# EAGLE design cw506_advbreak (EAGLE 7.5.0)

## Sheet 1 of 2
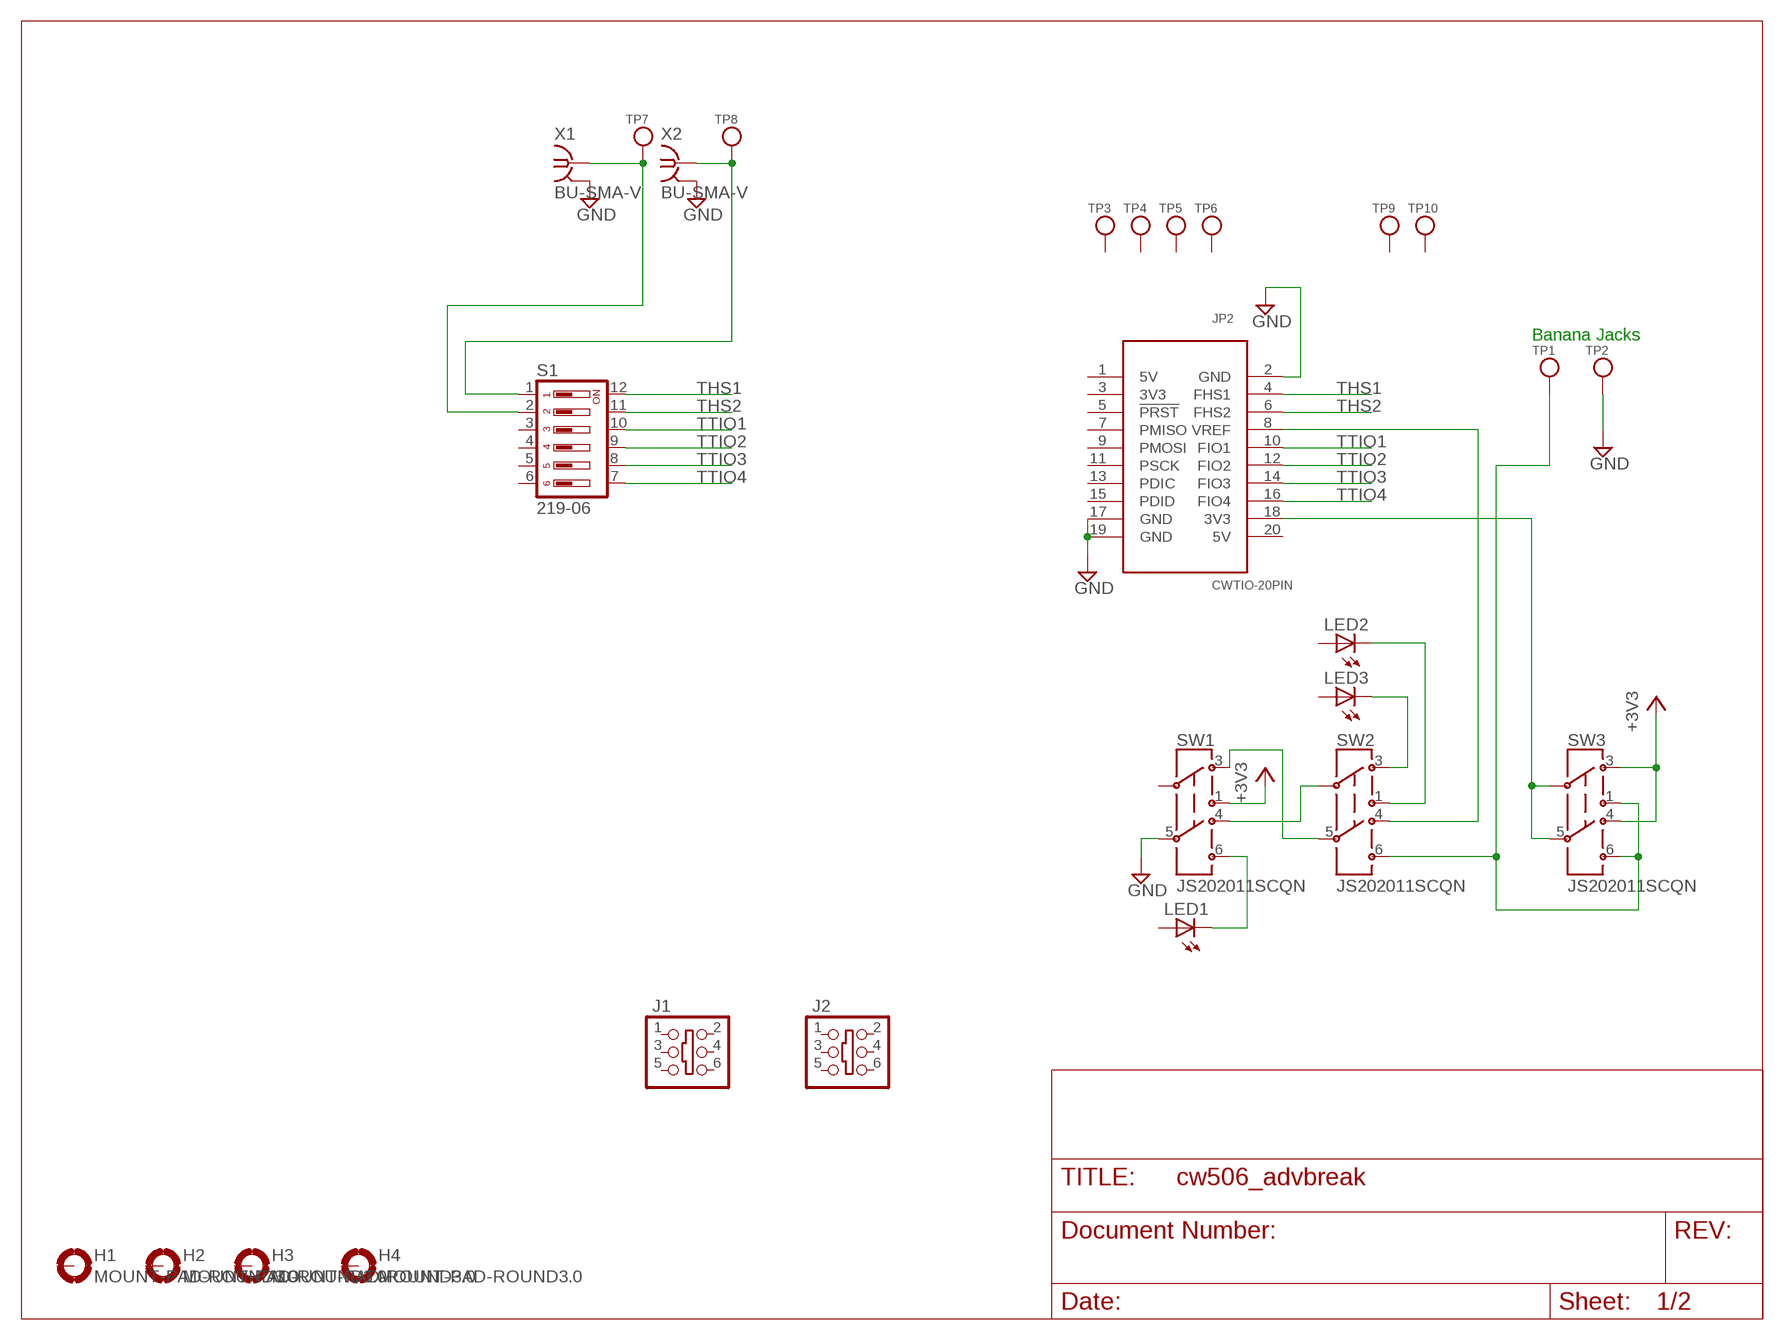
[diagram p0: schematic, sheet 1]

### Parts
H1  MOUNT-PAD-ROUND3.0  [3,0-PAD]
H2  MOUNT-PAD-ROUND3.0  [3,0-PAD]
H3  MOUNT-PAD-ROUND3.0  [3,0-PAD]
H4  MOUNT-PAD-ROUND3.0  [3,0-PAD]
J1  SHROUD_2X3  [PINSHRD_PTH_2X03]
J2  SHROUD_2X3  [PINSHRD_PTH_2X03]
JP2  CWTIO-20PIN  [PINSHRD_PTH_2X10]
LED1  LEDCHIP-LED0603  [CHIP-LED0603]
LED2  LEDCHIP-LED0603  [CHIP-LED0603]
LED3  LEDCHIP-LED0603  [CHIP-LED0603]
S1  219-06  [CTS-219-06]
SW1  JS202011SCQN  [JS202011SCQN]
SW2  JS202011SCQN  [JS202011SCQN]
SW3  JS202011SCQN  [JS202011SCQN]
TP1  TPK575-4  [KEYSTONE575-4]
TP2  TPK575-4  [KEYSTONE575-4]
TP3  TPKEYSTONE_COMPACT  [KEYSTONE_TPCOMPACT]
TP4  TPKEYSTONE_COMPACT  [KEYSTONE_TPCOMPACT]
TP5  TPKEYSTONE_COMPACT  [KEYSTONE_TPCOMPACT]
TP6  TPKEYSTONE_COMPACT  [KEYSTONE_TPCOMPACT]
TP7  TPKEYSTONE_COMPACT  [KEYSTONE_TPCOMPACT]
TP8  TPKEYSTONE_COMPACT  [KEYSTONE_TPCOMPACT]
TP9  TPKEYSTONE_COMPACT  [KEYSTONE_TPCOMPACT]
TP10  TPKEYSTONE_COMPACT  [KEYSTONE_TPCOMPACT]
X1  BU-SMA-V  [BU-SMA-V]
X2  BU-SMA-V  [BU-SMA-V]

### Nets
+3V3: SW1.1 SW3.3 SW3.4 ; also sheet 2
GND: JP2.2(GND) JP2.17(GND) JP2.19(GND) SW1.5 TP2.1(TP) X1.2 X1.3 X1.4 X1.5 X2.2 X2.3 X2.4 X2.5
N$1: SW1.3 SW2.5
N$2: LED1.C SW1.6
N$3: SW1.4 SW2.2
N$4: JP2.8(VREF) SW2.4
N$5: LED3.C SW2.3
N$6: LED2.C SW2.1
N$7: SW2.6 SW3.1 SW3.6 TP1.1(TP)
N$8: JP2.18(3V3) SW3.2 SW3.5
N$9: S1.2 TP7.1(TP) X1.1
N$10: S1.1 TP8.1(TP) X2.1
THS1: JP2.4(FHS1) S1.12
THS2: JP2.6(FHS2) S1.11
TTIO1: JP2.10(FIO1) S1.10
TTIO2: JP2.12(FIO2) S1.9
TTIO3: JP2.14(FIO3) S1.8
TTIO4: JP2.16(FIO4) S1.7
Unconnected: H1.B3,0(MOUNT) H2.B3,0(MOUNT) H3.B3,0(MOUNT) H4.B3,0(MOUNT) J1.1 J1.2 J1.3 J1.4 J1.5 J1.6 J2.1 J2.2 J2.3 J2.4 J2.5 J2.6 JP2.1(5V) JP2.3(3V3) JP2.5(!PRST) JP2.7(PMISO) JP2.9(PMOSI) JP2.11(PSCK) JP2.13(PDIC) JP2.15(PDID) JP2.20(5V) LED1.A LED2.A LED3.A S1.3 S1.4 S1.5 S1.6 SW1.2 TP3.1(TP) TP4.1(TP) TP5.1(TP) TP6.1(TP) TP9.1(TP) TP10.1(TP)

### Notes on the sheet
- Banana Jacks

## Sheet 2 of 2
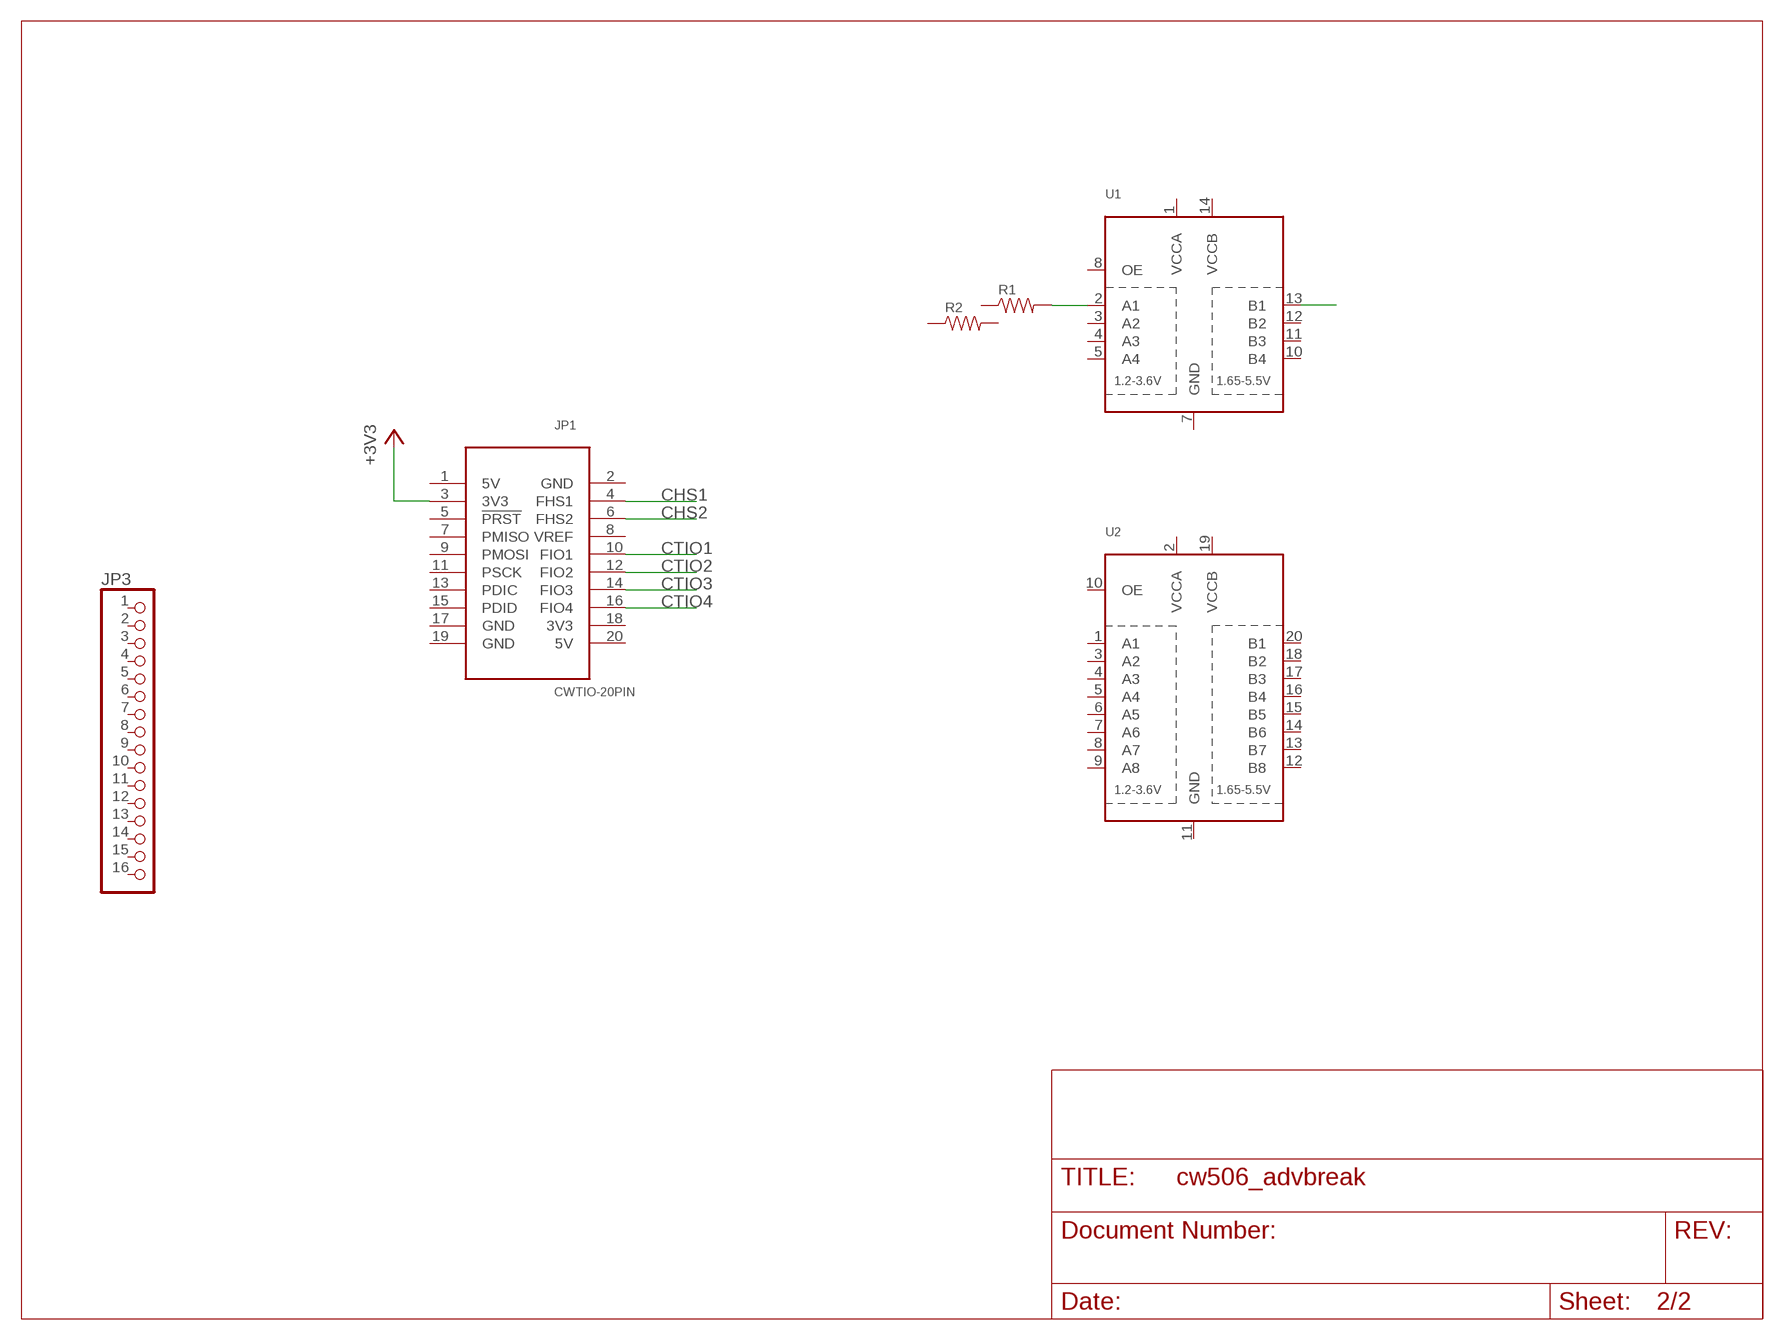
[diagram p1: schematic, sheet 2]

### Parts
JP1  CWTIO-20PIN  [PINSHRD_PTH_2X10]
JP3  PINHD-1X16  [1X16]
R1  RES0603-RES  [0603R]
R2  RES0603-RES  [0603R]
U1  TXB0104PWR  [TSSOP14]
U2  TXB0108PWR  [TSSOP20]

### Nets
+3V3: JP1.3(3V3) ; also sheet 1
CHS1: JP1.4(FHS1)
CHS2: JP1.6(FHS2)
CTIO1: JP1.10(FIO1)
CTIO2: JP1.12(FIO2)
CTIO3: JP1.14(FIO3)
CTIO4: JP1.16(FIO4)
N$11: R1.2 U1.2(A1)
N$15: U1.13(B1)
Unconnected: JP1.1(5V) JP1.2(GND) JP1.5(!PRST) JP1.7(PMISO) JP1.8(VREF) JP1.9(PMOSI) JP1.11(PSCK) JP1.13(PDIC) JP1.15(PDID) JP1.17(GND) JP1.18(3V3) JP1.19(GND) JP1.20(5V) JP3.1 JP3.2 JP3.3 JP3.4 JP3.5 JP3.6 JP3.7 JP3.8 JP3.9 JP3.10 JP3.11 JP3.12 JP3.13 JP3.14 JP3.15 JP3.16 R1.1 R2.1 R2.2 U1.1(VCCA) U1.3(A2) U1.4(A3) U1.5(A4) U1.7(GND) U1.8(OE) U1.10(B4) U1.11(B3) U1.12(B2) U1.14(VCCB) U2.1(A1) U2.2(VCCA) U2.3(A2) U2.4(A3) U2.5(A4) U2.6(A5) U2.7(A6) U2.8(A7) U2.9(A8) U2.10(OE) U2.11(GND) U2.12(B8) U2.13(B7) U2.14(B6) U2.15(B5) U2.16(B4) U2.17(B3) U2.18(B2) U2.19(VCCB) U2.20(B1)

## Library data of the parts
H1-H4 = holes:MOUNT-PAD-ROUND: MOUNTING PAD, round
J1 J2 = custom-std:SHROUD_2X3: 2x05 pin header
JP1 JP2 = chipwhisperer:CWTIO-20PIN
JP3 = pinhead:PINHD-1X16: PIN HEADER
LED1 = led:LED: LED OSRAM: - CHIPLED LG R971, LG N971, LY N971, LG Q971, LY Q971, LO R971, LY R971 LH N974, LH R974 LS Q976, LO Q976, LY Q976 LO Q996 - Hyper CHIPLED LW Q18S LB Q993, LB Q99A, LB R99A - SideLED LS A670, LO A670, LY A670, LG A670, LP A670 LB A673, LV A673, LT A673, LW A673 LH A674 LY A675 LS A676, LA A676, LO A676, LY A676, LW A676 LS A679, LY A679, LG A679 - Hyper Micro SIDELED® LS Y876, LA Y876, LO Y876, LY Y876 LT Y87S - SmartLED LW L88C, LW L88S LB L89C, LB L89S, LG L890 LS L89K, LO L89K, LY L89K LS L896, LA L896, LO L896, LY L896 - TOPLED LS T670, LO T670, LY T670, LG T670, LP T670 LSG T670, LSP T670, LSY T670, LOP T670, LYG T670 LG T671, LOG T671, LSG T671 LB T673, LV T673, LT T673, LW T673 LH T674 LS T676, LA T676, LO T676, LY T676, LB T676, LH T676, LSB T676, LW T676 LB T67C, LV T67C, LT T67C, LS T67K, LO T67K, LY T67K, LW E67C LS E67B, LA E67B, LO E67B, LY E67B, LB E67C, LV E67C, LT E67C LW T67C LS T679, LY T679, LG T679 LS T770, LO T770, LY T770, LG T770, LP T770 LB T773, LV T773, LT T773, LW T773 LH T774 LS E675, LA E675, LY E675, LS T675 LS T776, LA T776, LO T776, LY T776, LB T776 LHGB T686 LT T68C, LB T68C - Hyper Mini TOPLED® LB M676 - Mini TOPLED Santana® LG M470 LS M47K, LO M47K, LY M47K Source: http://www.osram.convergy.de LUXEON: - LUMILED® LXK2-PW12-R00, LXK2-PW12-S00, LXK2-PW14-U00, LXK2-PW14-V00 LXK2-PM12-R00, LXK2-PM12-S00, LXK2-PM14-U00 LXK2-PE12-Q00, LXK2-PE12-R00, LXK2-PE12-S00, LXK2-PE14-T00, LXK2-PE14-U00 LXK2-PB12-K00, LXK2-PB12-L00, LXK2-PB12-M00, LXK2-PB14-N00, LXK2-PB14-P00, LXK2-PB14-Q00 LXK2-PR12-L00, LXK2-PR12-M00, LXK2-PR14-Q00, LXK2-PR14-R00 LXK2-PD12-Q00, LXK2-PD12-R00, LXK2-PD12-S00 LXK2-PH12-R00, LXK2-PH12-S00 LXK2-PL12-P00, LXK2-PL12-Q00, LXK2-PL12-R00 Source: www.luxeon.com KINGBRIGHT: KA-3528ASYC Source: www.kingbright.com; SILKSCREEN: +3.3V
LED2 LED3 = led:LED: LED OSRAM: - CHIPLED LG R971, LG N971, LY N971, LG Q971, LY Q971, LO R971, LY R971 LH N974, LH R974 LS Q976, LO Q976, LY Q976 LO Q996 - Hyper CHIPLED LW Q18S LB Q993, LB Q99A, LB R99A - SideLED LS A670, LO A670, LY A670, LG A670, LP A670 LB A673, LV A673, LT A673, LW A673 LH A674 LY A675 LS A676, LA A676, LO A676, LY A676, LW A676 LS A679, LY A679, LG A679 - Hyper Micro SIDELED® LS Y876, LA Y876, LO Y876, LY Y876 LT Y87S - SmartLED LW L88C, LW L88S LB L89C, LB L89S, LG L890 LS L89K, LO L89K, LY L89K LS L896, LA L896, LO L896, LY L896 - TOPLED LS T670, LO T670, LY T670, LG T670, LP T670 LSG T670, LSP T670, LSY T670, LOP T670, LYG T670 LG T671, LOG T671, LSG T671 LB T673, LV T673, LT T673, LW T673 LH T674 LS T676, LA T676, LO T676, LY T676, LB T676, LH T676, LSB T676, LW T676 LB T67C, LV T67C, LT T67C, LS T67K, LO T67K, LY T67K, LW E67C LS E67B, LA E67B, LO E67B, LY E67B, LB E67C, LV E67C, LT E67C LW T67C LS T679, LY T679, LG T679 LS T770, LO T770, LY T770, LG T770, LP T770 LB T773, LV T773, LT T773, LW T773 LH T774 LS E675, LA E675, LY E675, LS T675 LS T776, LA T776, LO T776, LY T776, LB T776 LHGB T686 LT T68C, LB T68C - Hyper Mini TOPLED® LB M676 - Mini TOPLED Santana® LG M470 LS M47K, LO M47K, LY M47K Source: http://www.osram.convergy.de LUXEON: - LUMILED® LXK2-PW12-R00, LXK2-PW12-S00, LXK2-PW14-U00, LXK2-PW14-V00 LXK2-PM12-R00, LXK2-PM12-S00, LXK2-PM14-U00 LXK2-PE12-Q00, LXK2-PE12-R00, LXK2-PE12-S00, LXK2-PE14-T00, LXK2-PE14-U00 LXK2-PB12-K00, LXK2-PB12-L00, LXK2-PB12-M00, LXK2-PB14-N00, LXK2-PB14-P00, LXK2-PB14-Q00 LXK2-PR12-L00, LXK2-PR12-M00, LXK2-PR14-Q00, LXK2-PR14-R00 LXK2-PD12-Q00, LXK2-PD12-R00, LXK2-PD12-S00 LXK2-PH12-R00, LXK2-PH12-S00 LXK2-PL12-P00, LXK2-PL12-Q00, LXK2-PL12-R00 Source: www.luxeon.com KINGBRIGHT: KA-3528ASYC Source: www.kingbright.com
R1 R2 = custom-std:RES: Resistor Basic schematic elements and footprints for 0603, 1206, and PTH resistors.
S1 = switch-dil:219-06*: Surface Mount DIP Switch Series 219 SMT CTS Electronic Components Sourc: www.ctscorp.com; OC_FARNELL: unknown; OC_NEWARK: unknown
SW1-SW3 = customs:JS202011SCQN: SPDT Slide Switch Simple SMD single-pull double-throw slide switch. JS202011SCQN
TP1-TP10 = customs:TP
U1 = adafruit:TXB0104PWR: 4-Bit Bi-Directional Level Shifter 1.2V-3.6V (VCCA) to 1.65V-5.5V (VCCB) bi-directional level shifter with auto direction sensing. Max data rate - VCCA 1.8V: 20Mbps (50ns), VCCA 3.3V: 100Mbps (10ns) Digikey: 296-21929-1-ND
U2 = adafruit:TXB0108PWR: 8-Bit Bi-Directional Level Shifter 1.2V-3.6V (VCCA) to 1.65V-5.5V (VCCB) bi-directional level shifter with auto direction sensing. Max data rate - VCCA 1.8V: 20Mbps (50ns), VCCA 3.3V: 100Mbps (10ns) Digikey: 296-21527-1-ND
X1 X2 = con-coax:BU-SMA-V: FEMALE SMA CONNECTOR Radiall distributor RS 112-3794; OC_FARNELL: unknown; OC_NEWARK: unknown

## Board
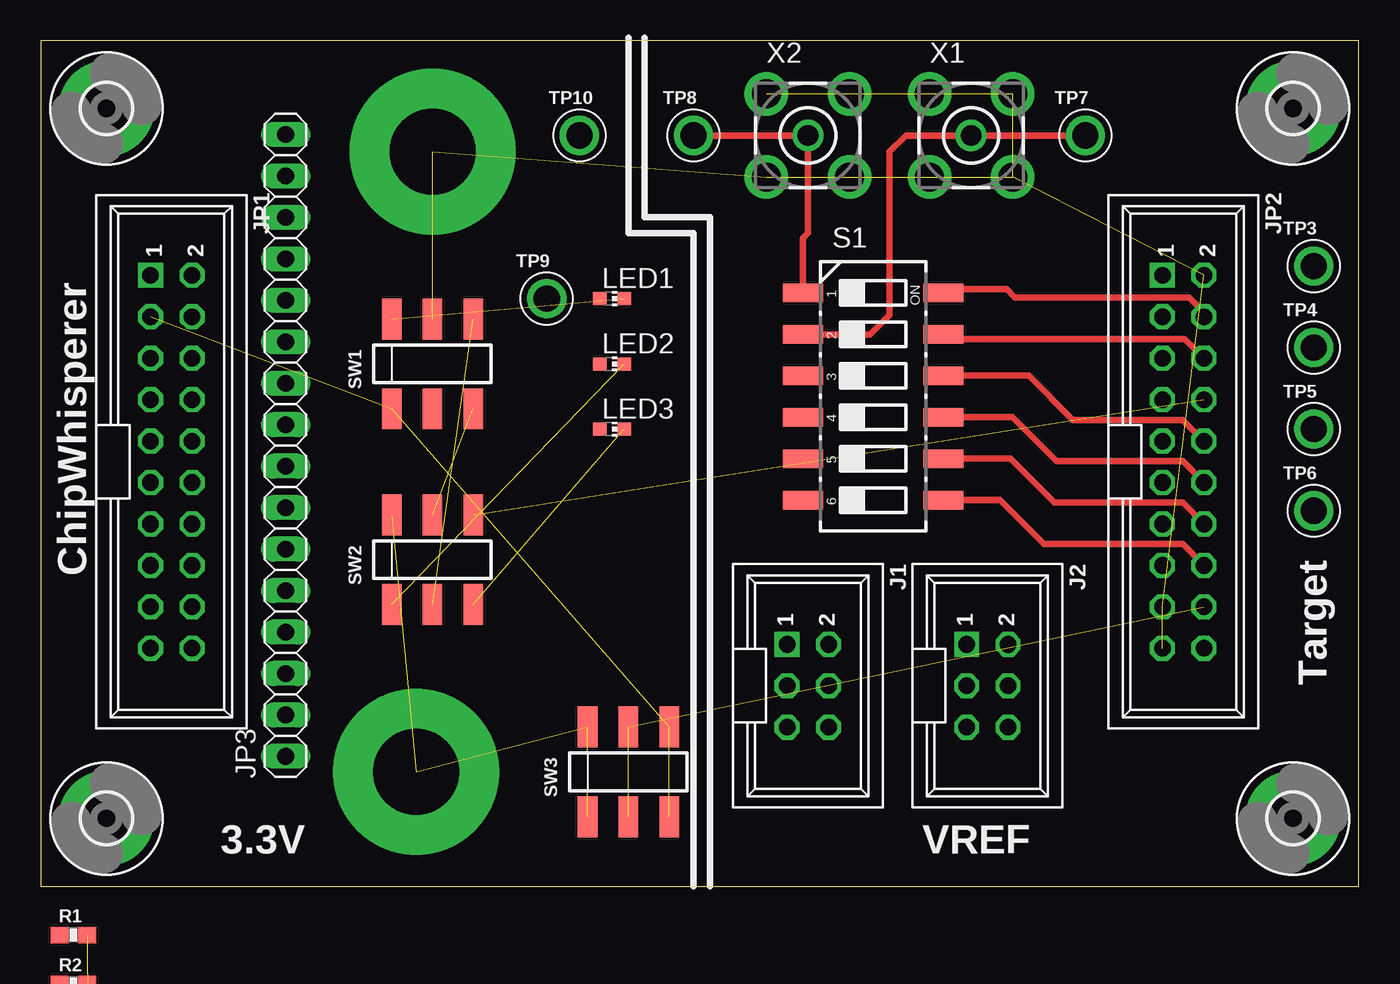
[diagram p2: board, top side]

Size 80.75 x 51.8 mm. Coordinates in mm from the lower left corner, seen from the top.
Outline: 0,0 80.75,0 80.75,51.8 0,51.8 0,0
Copper layers (1*16): Top 0.035mm / dielectric 1.5mm / Bottom 0.035mm
Design rules "default": minimum track width 10mil, minimum drill 24mil, track to track 8mil, track to pad 8mil, pad to pad 8mil, via to via 8mil, smd to smd 8mil, copper to edge 40mil, drill to drill 8mil, minimum pad ring 10mil, minimum via ring 8mil, stop-mask expansion 4mil, vias tented up to drill 0mil, thermal gap 10mil

### Footprints (pad centres in the part's own frame; a part is rotated, then mirrored left to right if it is on the bottom)
3,0-PAD = drill 3 pad 5.842: B3,0 0,0
PINSHRD_PTH_2X03 = drill 1.016 square: 1 -3.81,-1.27 | drill 1.016 octagon: 2 -3.81,1.27; 3 -1.27,-1.27; 4 -1.27,1.27; 5 1.27,-1.27; 6 1.27,1.27
PINSHRD_PTH_2X10 = drill 1.016 square: 1 -11.43,-1.27 | drill 1.016 octagon: 2 -11.43,1.27; 3 -8.89,-1.27; 4 -8.89,1.27; 5 -6.35,-1.27; 6 -6.35,1.27; 7 -3.81,-1.27; 8 -3.81,1.27; 9 -1.27,-1.27; 10 -1.27,1.27; 11 1.27,-1.27; 12 1.27,1.27; 13 3.81,-1.27; 14 3.81,1.27; 15 6.35,-1.27; 16 6.35,1.27; 17 8.89,-1.27; 18 8.89,1.27; 19 11.43,-1.27; 20 11.43,1.27
1X16 = drill 1.016 long: 1 -19.05,0; 2 -16.51,0; 3 -13.97,0; 4 -11.43,0; 5 -8.89,0; 6 -6.35,0; 7 -3.81,0; 8 -1.27,0; 9 1.27,0; 10 3.81,0; 11 6.35,0; 12 8.89,0; 13 11.43,0; 14 13.97,0; 15 16.51,0; 16 19.05,0
CHIP-LED0603 = smd 0.8 x 0.8: A 0,-0.75; C 0,0.75
0603R = smd 1.1 x 1: 1 -0.85,0; 2 0.85,0
CTS-219-06 = smd 1.13 x 2.44: 1 -6.35,-4.3; 2 -3.81,-4.3; 3 -1.27,-4.3; 4 1.27,-4.3; 5 3.81,-4.3; 6 6.35,-4.3; 7 6.35,4.3; 8 3.81,4.3; 9 1.27,4.3; 10 -1.27,4.3; 11 -3.81,4.3; 12 -6.35,4.3
JS202011SCQN = smd 1.2 x 2.5: 1 -2.5,-2.75; 2 0,-2.75; 3 2.5,-2.75; 4 2.5,2.75; 5 0,2.75; 6 -2.5,2.75
KEYSTONE575-4 = drill 5.283 pad 10.16: 1 0,0
KEYSTONE_TPCOMPACT = drill 1.6: 1 0,0
TSSOP14 = smd 0.305 x 0.991: 1 -1.95,-2.918; 2 -1.3,-2.918; 3 -0.65,-2.918; 4 0,-2.918; 5 0.65,-2.918; 6 1.3,-2.918; 7 1.95,-2.918; 8 1.95,2.918; 9 1.3,2.918; 10 0.65,2.918; 11 0,2.918; 12 -0.65,2.918; 13 -1.3,2.918; 14 -1.95,2.918
TSSOP20 = smd 0.305 x 0.991: 1 -2.925,-2.918; 2 -2.275,-2.918; 3 -1.625,-2.918; 4 -0.975,-2.918; 5 -0.325,-2.918; 6 0.325,-2.918; 7 0.975,-2.918; 8 1.625,-2.918; 9 2.275,-2.918; 10 2.925,-2.918; 11 2.925,2.918; 12 2.275,2.918; 13 1.625,2.918; 14 0.975,2.918; 15 0.325,2.918; 16 -0.325,2.918; 17 -0.975,2.918; 18 -1.625,2.918; 19 -2.275,2.918; 20 -2.925,2.918
BU-SMA-V = drill 1.27: 1 0,0 | drill 1.778: 2 -2.55,2.55; 3 2.55,2.55; 4 2.55,-2.55; 5 -2.55,-2.55

### Placement (x,y rotation side)
H1  4.03,4.15 0 top
H2  76.72,4.15 0 top
H3  76.72,47.65 0 top
H4  4.03,47.65 0 top
J1  47,11 270 top
J2  58,11 270 top
JP1  8,26 270 top
JP2  70,26 270 top
JP3  15,27 90 top
LED1  35,36 270 top
LED2  35,32 270 top
LED3  35,28 270 top
R1  2,-3 0 top
R2  2,-6 0 top  (outside the outline)
S1  51,30 270 top
SW1  24,32 0 top
SW2  24,20 0 top
SW3  36,7 0 top
TP1  23,7 0 top
TP2  24,45 0 top
TP3  78,38 0 top
TP4  78,33 0 top
TP5  78,28 0 top
TP6  78,23 0 top
TP7  64,46 0 top
TP8  40,46 0 top
TP9  31,36 0 top
TP10  33,46 0 top
U1  4.32,-28.57 0 top  (outside the outline)
U2  4.95,-35.69 0 top  (outside the outline)
X1  57,46 0 top
X2  47,46 0 top

### Tracks (layer width: path | path; a pad name or v marks a point on that pad's centre or on a via)
+3V3  (3 unrouted)
GND  (12 unrouted)
N$1  (1 unrouted)
N$2  (1 unrouted)
N$3  (1 unrouted)
N$4  (1 unrouted)
N$5  (1 unrouted)
N$6  (1 unrouted)
N$7  (3 unrouted)
N$8  (2 unrouted)
N$9
  Top 0.406: S1.2 50.81,33.81 52,35 52,45 53,46 X1.1 TP7.1
N$10
  Top 0.406: S1.1 46.7,39.7 47,40 X2.1 TP8.1
N$11  (1 unrouted)
THS1
  Top 0.406: JP2.4 71.27,35.16 70.36,36.07 59.69,36.07 59.18,36.58 55.53,36.58 S1.12
THS2
  Top 0.406: JP2.6 71.27,32.36 70.1,33.53 55.58,33.53 S1.11
TTIO1
  Top 0.406: JP2.10 69.97,28.57 63.25,28.57 60.55,31.27 S1.10
TTIO2
  Top 0.406: JP2.12 69.97,26.04 62.23,26.04 59.53,28.73 S1.9
TTIO3
  Top 0.406: JP2.14 69.97,23.5 62.1,23.5 59.41,26.19 S1.8
TTIO4
  Top 0.406: JP2.16 69.97,20.95 61.47,20.95 58.77,23.65 S1.7

### Text on the board
tPlace: ChipWhisperer | Target | 3.3V | VREF